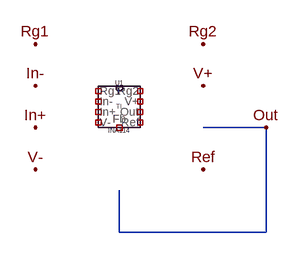
[diagram p0: schematic INA114-OPAMP.asc]
INA114-OPAMP.asc, the LTspice schematic file:
Version 4
SHEET 1 880 680
WIRE 512 416 416 416
WIRE 288 576 288 512
WIRE 512 576 512 416
WIRE 512 576 288 576
FLAG 160 288 Rg1
FLAG 160 352 In-
FLAG 160 416 In+
FLAG 160 480 V-
FLAG 416 352 V+
FLAG 416 288 Rg2
FLAG 512 416 Out
FLAG 416 480 Ref
SYMBOL INA114 288 384 R0
SYMATTR InstName U1

The netlist it stands for:
* INA114-OPAMP.asc
XU1 NC_01 NC_02 NC_03 NC_04 NC_05 NC_06 NC_07 NC_08 NC_09 INA114  ; pins In+ In- V+ V- Out Fb Ref Rg1 Rg2
.lib INA114.sub
.backanno
.end